# Altium schematic sheet STM32F1_MCU.SchDoc
size 420 x 297 mm; SheetNumber: 1; SheetTotal: 2
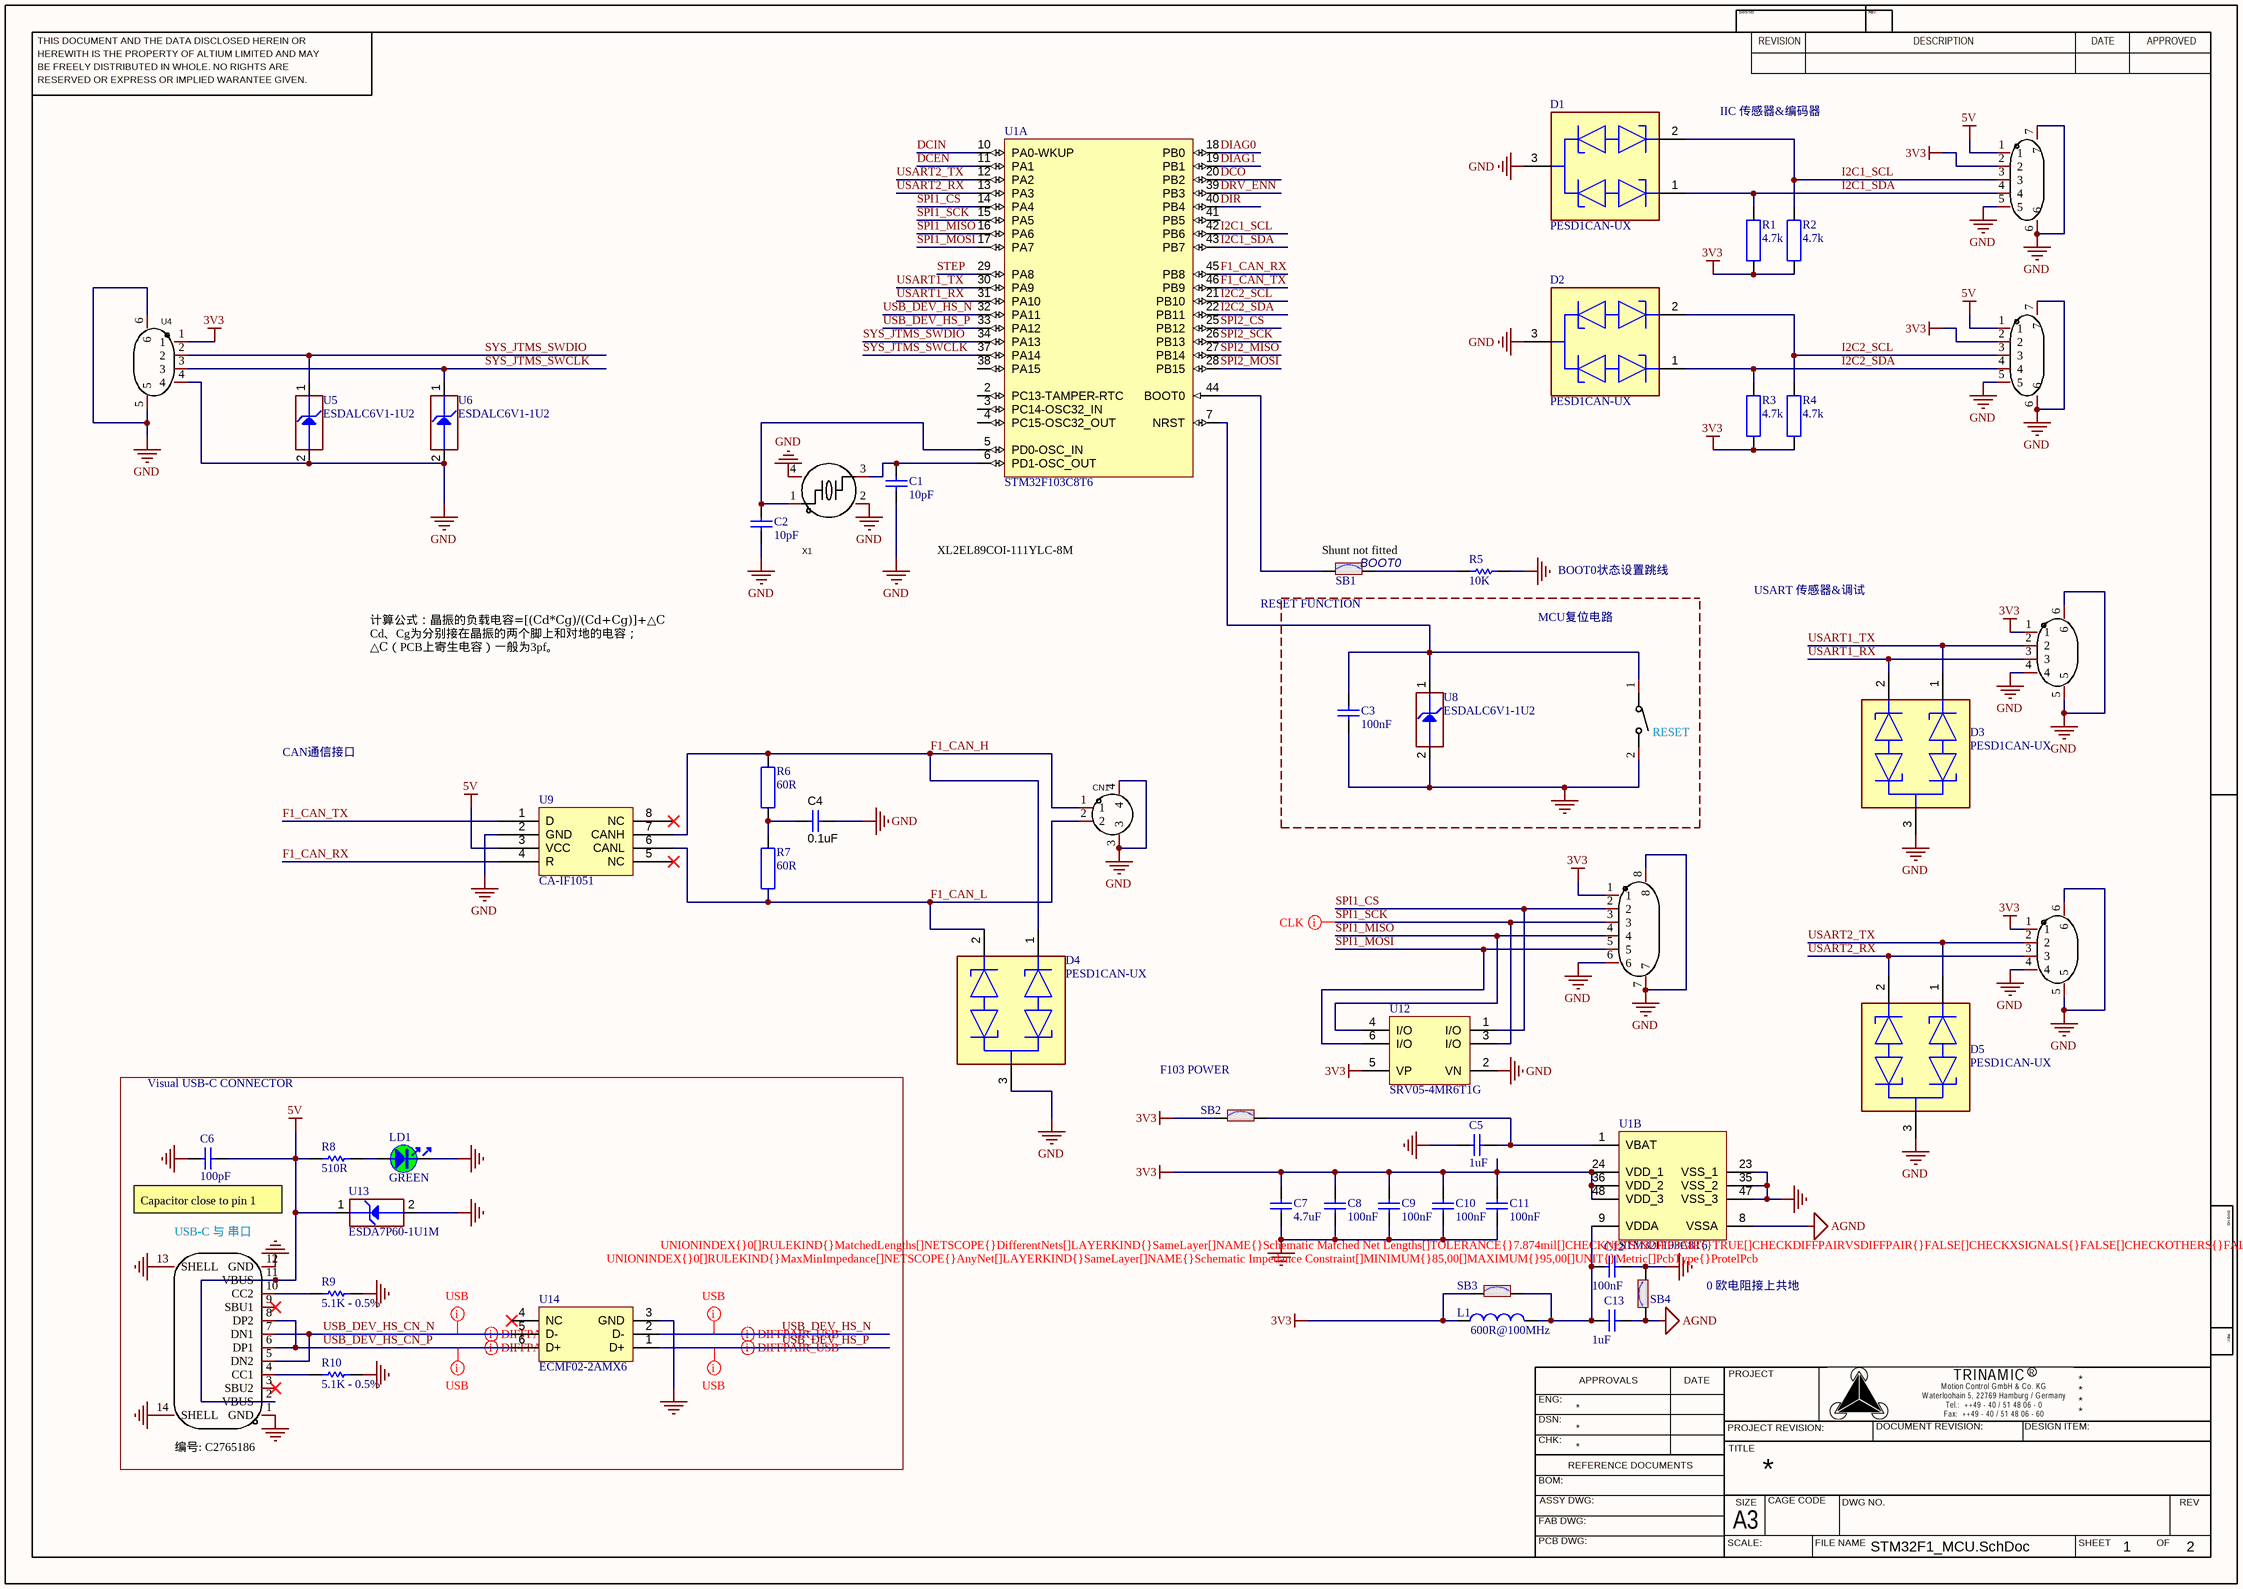
[diagram p0: STM32F1_MCU.SchDoc]

## Parts
C1  value 10pF  [C0402]
C2  value 10pF  [C0402]
C3  value 100nF  [C0402]
C4  ValueDisplayed: 0.1uF  [0603L]  (hidden comment: GRM188R61E105KA12D)
C5  value 1uF  [C0603]
C6  value 100pF  [C0402]
C7  value 4.7uF  [C0603]
C8  value 100nF  [C0402]
C9  value 100nF  [C0402]
C10  value 100nF  [C0402]
C11  value 100nF  [C0402]
C12  value 100nF  [C0402]
C13  value 1uF  [C0603]
CN1  WAFER-GH1.25-2PWB  [CONN-TH_2P-P1.25_XUNPU_WAFER-GH1.25-2PWB]  (value not drawn)
D1  PESD1CAN-UX  [FP-SOT323-MFG]
D2  PESD1CAN-UX  [FP-SOT323-MFG]
D3  PESD1CAN-UX  [FP-SOT323-MFG]
D4  PESD1CAN-UX  [FP-SOT323-MFG]
D5  PESD1CAN-UX  [FP-SOT323-MFG]
L1  value 600R@100MHz  [L0603]
LD1  value GREEN  [LED_0603_GREEN]
R1  4.7k  [RESC1608X55N]
R2  4.7k  [RESC1608X55N]
R3  4.7k  [RESC1608X55N]
R4  4.7k  [RESC1608X55N]
R5  value 10K  [R0603]
R6  60R  [RESC1608X55N]
R7  60R  [RESC1608X55N]
R8  value 510R  [R0603]
R9  value 5.1K - 0.5%  [R0603]
R10  value 5.1K - 0.5%  [R0603]
SB1  MCD-00071  [SOLDER-BRIDGE_R0603-0R]  (value not drawn)
SB2  (no value)  [SOLDER-BRIDGE_R0603-0R]
SB3  (no value)  [SOLDER-BRIDGE_R0603-0R]
SB4  (no value)  [SOLDER-BRIDGE_R0603-0R]
SW1  TS-1088-AR02016  [SW-SMD_L3.9-W3.0-P4.45]  (value not drawn)
U1  STM32F103C8T6  [STM-LQFP48_L]  (parts A,B of 2)
U2  WAFER-GH1.25-5PWB  [CONN-SMD_5P-P1.25_XUNPU_WAFER-GH1.25-5PWB]  (value not drawn)
U3  WAFER-GH1.25-5PWB  [CONN-SMD_5P-P1.25_XUNPU_WAFER-GH1.25-5PWB]  (value not drawn)
U4  WAFER-GH1.25-4PWB  [CONN-SMD_4P-P1.25_XUNPU_WAFER-GH1.25-4PWB]  (value not drawn)
U5  value ESDALC6V1-1U2  [ESD_ST0201]
U6  value ESDALC6V1-1U2  [ESD_ST0201]
U7  WAFER-GH1.25-4PWB  [CONN-SMD_4P-P1.25_XUNPU_WAFER-GH1.25-4PWB]  (value not drawn)
U8  value ESDALC6V1-1U2  [ESD_ST0201]
U9  CA-IF1051  [SOIC127P600X175-8N]
U10  WAFER-GH1.25-6PWB  [CONN-SMD_6P-P1.25_XUNPU_WAFER-GH1.25-6PWB]  (value not drawn)
U11  WAFER-GH1.25-4PWB  [CONN-SMD_4P-P1.25_XUNPU_WAFER-GH1.25-4PWB]  (value not drawn)
U12  SRV05-4MR6T1G  [ONSC-TSOP-6-318G-02_V]
U13  value ESDA7P60-1U1M  [ESD_QFN2_1P6X1_P125]
U14  value ECMF02-2AMX6  [ESD_QFN-6L_1P7X1P5_P050]  (hidden comment: ​)
USB1  TYPE-C 16PIN 2MD(073)  [USB-C-SMD_TYPE-C-6PIN-2MD-073]  (value not drawn)
X1  8MHz  [CRYSTAL-SMD_4P-L3.2-W2.5-BL-1]  (value not drawn)

## Nets
3V3: C7.2 C8.2 C9.2 C10.2 C11.2 L1.1 R1.2 R2.2 R3.2 R4.2 SB2.1 SB3.1 U1.24(VDD_1) U1.36(VDD_2) U1.48(VDD_3) U2.2 U3.2 U4.1 U7.1 U10.1 U11.1 U12.5(VP)
5V: C6.2 R8.2 U2.1 U3.1 U9.3(VCC) U13.1(IO1) USB1.2(VBUS) USB1.11(VBUS)
AGND: C13.1 SB4.1 U1.8(VSSA)
GND: C1.2 C2.2 C3.1 C4.2 C5.1 C6.1 C7.1 C8.1 C9.1 C10.1 C11.1 C12.1 CN1.3 CN1.4 D1.3(common_cathode) D2.3(common_cathode) D3.3(common_cathode) D4.3(common_cathode) D5.3(common_cathode) LD1.2 R5.1 R9.1 R10.1 SB4.2 SW1.2 U1.23(VSS_1) U1.35(VSS_2) U1.47(VSS_3) U2.5 U2.6 U2.7 U3.5 U3.6 U3.7 U4.4 U4.5 U4.6 U5.2(GND) U6.2(GND) U7.4 U7.5 U7.6 U8.2(GND) U9.2(GND) U10.6 U10.7 U10.8 U11.4 U11.5 U11.6 U12.2(VN) U13.2(GND) U14.3(GND) USB1.1(GND) USB1.12(GND) USB1.13(SHELL) USB1.14(SHELL) X1.2(GND) X1.4(GND)
DCEN: U1.11(PA1)
DCIN: U1.10(PA0-WKUP)
DCO: U1.20(PB2)
DIAG0: U1.18(PB0)
DIAG1: U1.19(PB1)
DIR: U1.40(PB4)
DRV_ENN: U1.39(PB3)
F1_CAN_H: CN1.1 D4.1(cathode_1) R6.2 U9.7(CANH)
F1_CAN_L: CN1.2 D4.2(cathode_2) R7.1 U9.6(CANL)
F1_CAN_RX: U1.45(PB8) U9.4(R)
F1_CAN_TX: U1.46(PB9) U9.1(D)
I2C1_SCL: D1.2(cathode_2) R2.1 U1.42(PB6) U2.3
I2C1_SDA: D1.1(cathode_1) R1.1 U1.43(PB7) U2.4
I2C2_SCL: D2.2(cathode_2) R4.1 U1.21(PB10) U3.3
I2C2_SDA: D2.1(cathode_1) R3.1 U1.22(PB11) U3.4
SPI1_CS: U1.14(PA4) U10.2 U12.1(I/O)
SPI1_MISO: U1.16(PA6) U10.4 U12.4(I/O)
SPI1_MOSI: U1.17(PA7) U10.5 U12.6(I/O)
SPI1_SCK: U1.15(PA5) U10.3 U12.3(I/O)
SPI2_CS: U1.25(PB12)
SPI2_MISO: U1.27(PB14)
SPI2_MOSI: U1.28(PB15)
SPI2_SCK: U1.26(PB13)
STEP: U1.29(PA8)
SYS_JTMS_SWCLK: U1.37(PA14) U4.3 U6.1(IO1)
SYS_JTMS_SWDIO: U1.34(PA13) U4.2 U5.1(IO1)
USART1_RX: D3.2(cathode_2) U1.31(PA10) U7.3
USART1_TX: D3.1(cathode_1) U1.30(PA9) U7.2
USART2_RX: D5.2(cathode_2) U1.13(PA3) U11.3
USART2_TX: D5.1(cathode_1) U1.12(PA2) U11.2
USB_DEV_HS_CN_N: U14.5(D-) USB1.5(DN2) USB1.7(DN1)
USB_DEV_HS_CN_P: U14.6(D+) USB1.6(DP1) USB1.8(DP2)
USB_DEV_HS_N: U1.32(PA11) U14.2(D-)
USB_DEV_HS_P: U1.33(PA12) U14.1(D+)
NetC1_1: C1.1 U1.6(PD1-OSC_OUT) X1.3
NetC2_1: C2.1 U1.5(PD0-OSC_IN) X1.1
NetC3_2: C3.2 SW1.1 U1.7(NRST) U8.1(IO1)
NetC4_1: C4.1 R6.1 R7.2
NetC5_2: C5.2 SB2.2 U1.1(VBAT)
NetC12_2: C12.2 C13.2 L1.2 SB3.2 U1.9(VDDA)
NetLD1_1: LD1.1 R8.1
NetR5_2: R5.2 SB1.2
NetR9_2: R9.2 USB1.10(CC2)
NetR10_2: R10.2 USB1.4(CC1)
NetSB1_1: SB1.1 U1.44(BOOT0)

Not connected (* = marked no-connect by the designer): U1 2(PC13-TAMPER-RTC) 3(PC14-OSC32_IN) 4(PC15-OSC32_OUT) 38(PA15) 41(PB5); U9 5(NC)* 8(NC)*; U14 4(NC)*; USB1 3(SBU2)* 9(SBU1)*

## Layout directives
differential pair; rule Impedance Constraint [Min = 85.00    Max = 95.00    ]: USB_DEV_HS_CN_N, USB_DEV_HS_CN_P, USB_DEV_HS_N, USB_DEV_HS_P
rule Undefined; rule Matched Net Lengths [Tolerance = 0.2mm]; rule Impedance Constraint [Min = 85.00    Max = 95.00    ]: USB_DEV_HS_CN_N, USB_DEV_HS_CN_P, USB_DEV_HS_N, USB_DEV_HS_P
mark named CLK: SPI1_SCK

## Notes on the sheet
- IIC 传感器&编码器
- XL2EL89COI-111YLC-8M
- (near SB1) Shunt not fitted
- BOOT0
- BOOT0状态设置跳线
- USART 传感器&调试
- 计算公式：晶振的负载电容=[(Cd*Cg)/(Cd+Cg)]+△C
  Cd、Cg为分别接在晶振的两个脚上和对地的电容；
  △C（PCB上寄生电容）一般为3pf。
- RESET FUNCTION
- MCU复位电路
- CAN通信接口
- (near SW1) RESET
- (near SB2) F103 POWER
- Visual USB-C CONNECTOR
- (near C6) Capacitor close to pin 1
- (near USB1) USB-C 与 串口
- 0 欧电阻接上共地
- (near USB1) 编号: C2765186
- THIS DOCUMENT AND THE DATA DISCLOSED HEREIN OR
- HEREWITH IS THE PROPERTY OF ALTIUM LIMITED AND MAY
- DWG NO:
- REVISION
- REV:
- DESCRIPTION
- DATE
- APPROVED
- BE FREELY DISTRIBUTED IN WHOLE. NO RIGHTS ARE
- RESERVED OR EXPRESS OR IMPLIED WARANTEE GIVEN.
- ENG:
- APPROVALS
- PROJECT
- DSN:
- CHK:
- REFERENCE DOCUMENTS
- PROJECT REVISION:
- TITLE
- DOCUMENT REVISION:
- DESIGN ITEM:
- BOM:
- FAB DWG:
- PCB DWG:
- ASSY DWG:
- SCALE:
- A3
- SIZE
- CAGE CODE
- FILE NAME
- DWG NO.
- SHEET
- OF
- REV

## Library data of the parts
C1 C2 = MCD-00003: Capacitor, MLCC, 5.1pF, 50V, NPO, +-0.25pF, 0402, T=0.5mm; Manufacturer_Part_Number: CC0402CRNPO9BN5R1; Manufacturer: YAGEO; ECCN_US: EAR99; ECCN_EU: NEC; Provided_By: SUBCO; Internal_Part_Number: MCD-00003; ComponentLink1Description: Datasheet; Status: Released; Part_Type: Capacitor; Package: C0402; ComponentLink1URL: http://tunmcdsvn.tun.st.com/Component_Datasheet_Library/Trunk/Capacitors/Yageo_Capacitor_NP0_16V-to-50V
C3 C8-C12 = MCD-00102: Capacitor, MLCC, 100nF, 16V, X7R, 10%, 0402, T=0,5mm; Manufacturer_Part_Number: CC0402KRX7R7BB104; Manufacturer: YAGEO; Provided_By: Subcon; Initial_Board_Reference: MB1262; Internal_Part_Number: MCD-00102; Status: Released; Package: C0402; ComponentLink1Description: Yageo_Capacitor_X7R-series.pdf; ECCN_US: n/a; ECCN_EU: n/a; Part_Type: Capacitor; ComponentLink1URL: http://tunmcdsvn.tun.st.com/Component_Datasheet_Library/Trunk/Capacitors/Yageo_Multilayer_Capacitor_X7R_series_100pF_to_22uF
C4 = GRM188R61E105KA12D: CAP, CERM, 0.1uF, 25V, +/-10%, X5R, 0603; Manufacturer: MuRata; Polarized: N; CompType: Capacitor; Value: 1uF; U/M: EA; Cap_F: 0.000001; Tolerance_%: 10; Value1: Unknown; VDC_V: 25; TaMin_C: -55; TaMax_C: 85; Cap_Case: 0603; SymbolVersion: 2008-07-09; PartNumber: GRM188R61E105KA12D; PackageReference: 0603; RoHS: Y; Value2: 25V; MountType: SMT; Technology: Ceramic; TempCo: X5R; Published: 2008-06-19; Publisher: Texas Instruments; LatestRevisionDate: 2013-05-24; LatestRevisionNote: Changed publisher; ComponentLink1Description: Datasheet link; ComponentLink1URL: http://search.murata.co.jp/Ceramy/PnsearchViewAction.do?HnOFG=ON&HnNFG=ON&SEL_CNT=50&sLang=en&sKey=GRM188R61E105KA12D&x=9&y=9&search=startwith; Supplier 1: Digi-Key; Supplier Part Number 1: 490-3897-1-ND; Supplier 2: Mouser; Supplier Part Number 2: 81-GRM188R61E105KA12; Supplier 3: Farnell; Supplier Part Number 3: 1828802
C5 C13 = MCD-00010: Capacitor, MLCC, 1uF, 16V, X5R, 10%, 0603, T=0,8mm; Manufacturer_Part_Number: CC0603KRX5R7BB105; Manufacturer: YAGEO; Provided_By: Subcon; Initial_Board_Reference: MB1274; Internal_Part_Number: MCD-00010; Status: Released; Package: C0603; ComponentLink1Description: Yageo_Capacitor_X5R-series.pdf; ECCN_US: n/a; ECCN_EU: n/a; Part_Type: Capacitor; ComponentLink1URL: http://tunmcdsvn.tun.st.com/Component_Datasheet_Library/Trunk/Capacitors/Yageo_Multilayer_capacitor_X5R_series_100pF_to_100uF
C6 = MCD-00205: Capacitor, MLCC, 100pF, 50V, NPO, 5%, 0402, T=0,5mm; Manufacturer_Part_Number: CC0402JRNPO9BN101; Manufacturer: YAGEO; Provided_By: Subcon; Internal_Part_Number: MCD-00205; Status: Footprint available; Part_Type: Capacitor; Package: C0402; ComponentLink1Description: Yageo_Capacitor_NP0_16V-to-50V.pdf; ComponentLink1URL: http://tunmcdsvn.tun.st.com/Component_Datasheet_Library/Trunk/Capacitors/Yageo_Capacitor_NP0_16V-to-50V
C7 = MCD-00009: Capacitor, MLCC, 4.7uF, 16V, X5R, 10%, 0603, T=0.8mm; Manufacturer_Part_Number: CC0603KRX5R7BB475; Manufacturer: YAGEO; Provided_By: subcon; Initial_Board_Reference: MB1274; Internal_Part_Number: MCD-00009; ComponentLink1Description: Yageo_Capacitor_X5R-series.pdf; ECCN_US: n/a; ECCN_EU: n/a; Status: Released; Part_Type: Capacitor; Package: C0603; ComponentLink1URL: http://tunmcdsvn.tun.st.com/Component_Datasheet_Library/Trunk/Capacitors/Yageo_Multilayer_capacitor_X5R_series_100pF_to_100uF
CN1 = WAFER-GH1.25-2PWB: Manufacturer: XUNPU(讯普); Add into BOM: yes; Pins Structure: 1x2P; Pitch: 1.25mm; Reference Series: GH; Number of PINs Per Row: 2; Current Rating (Max): 1A; Symbol: WAFER-GH1.25-2PWB; Device: WAFER-GH1.25-2PWB; LCSC Part Name: 1x2P 间距:1.25mm 卧贴 系列:GH; Supplier Part: C3029377; Manufacturer Part: WAFER-GH1.25-2PWB; Supplier Footprint: SMD,P=1.25mm,卧贴; JLCPCB Part Class: Extended Part; Datasheet: https://atta.szlcsc.com/upload/public/pdf/source/20220527/CB8773BFB0913C3B8ABD62CB38BA101A.pdf; Supplier: LCSC; Convert to PCB: yes; Mounting Style: 卧贴; Number of Pins: 2P; Number of Rows: 1; Operating Temperature Range: -25℃~+85℃
D1-D5 = CMP-14436-000006-1: TVS DIODE 24V 50V SC70-3
L1 = MCD-00047: SMD Chip ferrite bead, 600R@100MHz +/-25%, 350mA, 500mohm DC, 0603, T=0.8mm; Part_Type: Inductor; Manufacturer_Part_Number: FCM1608KF-601T03; Manufacturer: TAI-TECH; Provided_By: SUBCO; Internal_Part_Number: MCD-00047; Status: Released; ComponentLink1Description: Datasheet; ComponentLink1URL: http://tunmcdsvn.tun.st.com/Component_Datasheet_Library/Trunk/Inductors/TaiTech_Bead_FCM1608_series; ECCN_US: n/a; ECCN_EU: n/a
LD1 = MCD-00050: LED, Green, 0603; Manufacturer_Part_Number: 19-213SYGC/S530-E2/TR8; Manufacturer: EVERLIGHT; Part_Type: Display; ECCN_US: EAR99; ECCN_EU: NEC; Provided_By: SUBCO; Internal_Part_Number: MCD-00050; ComponentLink1Description: Datasheet; Status: Released; ComponentLink1URL: http://tunmcdsvn.tun.st.com/Component_Datasheet_Library/Trunk/Display/Everlight_SMD-LED-GREEN_19-213SYGC-S530-XX-TR8-v3.doc; Package: LED 0603
R1-R4 = RC0603FR-073K3L: RES SMD 4.7K OHM 1% 1/10W 0603; Manufacturer: Yageo; Resistance (Ohms): 3.3k; Power (Watts): 0.1W, 1/10W; Temperature Coefficient: ±100ppm/°C; Supplier 1: Digi-Key; Supplier Part Number 1: 311-3.30KHRCT-ND; Manufacturer Part Number: RC0603FR-073K3L; RoHS: RoHS Compliant; Category: Resistors; Stock 1: 420019; Pricing 1: 1=0.1, 10=0.014, 25=0.01, 100=0.0057, 250=0.00436, 500=0.00348, 1000=0.00257, 2500=0.00223 (USD); Packaging: Cut Tape (CT); Tolerance: ±1%; Composition: Thick Film; Features: Moisture Resistant; Operating Temperature: -55°C ~ 155°C; Package / Case: 0603 (1608 Metric); Supplier Device Package: 0603; Size / Dimension: 0.063" L x 0.031" W (1.60mm x 0.80mm); Height: 0.022" (0.55mm); Number of Terminations: 2; ComponentLink1URL: http://www.yageo.com/documents/recent/PYu-RC_Group_51_RoHS_L_04.pdf; ComponentLink1Description: http://www.yageo.com/documents/recent/PYu-RC_Group_51_RoHS_L_04.pdf
R5 = MCD-00220: Resistor,10K,0603,1%,1/10W; Manufacturer_Part_Number: RC0603FR-0710KL; Manufacturer: YAGEO; Provided_By: Subcon; Initial_Board_Reference: MB1319; Internal_Part_Number: MCD-00220; ECCN_US: n/a; ECCN_EU: n/a; ComponentLink1Description: Yageo_Resistor_RC0603-series.pdf; Status: Released; Part_Type: Resistor; Package: R0603; ComponentLink1URL: http://tunmcdsvn.tun.st.com/Component_Datasheet_Library/Trunk/Resistors/Yageo_Resistor_RC0603-series
R6 R7 = RC0603FR-07120RL: RES SMD 60 OHM 1% 1/10W 0603; Manufacturer: Yageo; Resistance (Ohms): 120; Power (Watts): 0.1W, 1/10W; Temperature Coefficient: ±100ppm/°C; Supplier 1: Digi-Key; Supplier Part Number 1: 311-120HRCT-ND; Manufacturer Part Number: RC0603FR-07120RL; RoHS: RoHS Compliant; Category: Resistors; Stock 1: 1545282; Pricing 1: 1=0.1, 10=0.014, 25=0.01, 100=0.0057, 250=0.00436, 500=0.00348, 1000=0.00257, 2500=0.00223 (USD); Packaging: Cut Tape (CT); Tolerance: ±1%; Composition: Thick Film; Features: Moisture Resistant; Operating Temperature: -55°C ~ 155°C; Package / Case: 0603 (1608 Metric); Supplier Device Package: 0603; Size / Dimension: 0.063" L x 0.031" W (1.60mm x 0.80mm); Height: 0.022" (0.55mm); Number of Terminations: 2; ComponentLink1URL: http://www.yageo.com/documents/recent/PYu-RC_Group_51_RoHS_L_04.pdf; ComponentLink1Description: http://www.yageo.com/documents/recent/PYu-RC_Group_51_RoHS_L_04.pdf
R8 = MCD-00225: Resistor,510R,0603,1%,1/10W; Manufacturer_Part_Number: RC0603FR-07510RL; Manufacturer: YAGEO; ECCN_US: EAR99; ECCN_EU: NEC; Provided_By: SUBCO; Internal_Part_Number: MCD-00225; ComponentLink1Description: Datasheet; Status: Released; Part_Type: Resistor; Package: R0603; ComponentLink1URL: http://tunmcdsvn.tun.st.com/Component_Datasheet_Library/Trunk/Resistors/Yageo_Resistor_RC0603-series
R9 R10 = MCD-01209: Resistor,5.1K,0603,0.5%,1/10W; Manufacturer_Part_Number: RC0603DR-0733KL; Manufacturer: YAGEO; ECCN_US: EAR99; ECCN_EU: NEC; Provided_By: SUBCO; Internal_Part_Number: MCD-01209; Status: Checked; Part_Type: Resistor; Package: R0603; ComponentLink1Description: Datasheet; ComponentLink1URL: http://tunmcdsvn.tun.st.com/Component_Datasheet_Library/Trunk/Resistors/Yageo_Resistor_RC0603-series/RC_Group_51_RoHS_L_7.pdf
SB1-SB4 = MCD-00071: Solder Bridge ON; Part_Type: Mechanical; Manufacturer_Part_Number: RC0603JR-070RL; Manufacturer: YAGEO; Provided_By: SUBCO; Internal_Part_Number: MCD-00071; ECCN_US: n/a; ECCN_EU: n/a; Status: Released; Package: SB0603; ComponentLink1Description: Datasheet; ComponentLink1URL: http://tunmcdsvn.tun.st.com/Component_Datasheet_Library/Trunk/Resistors/Yageo_Resistor_RC0603-series
SW1 = TS-1088-AR02016: Manufacturer: XUNPU(讯普); Add into BOM: yes; Circuit: 单刀单掷; Actuator Style: 圆形按钮; Operating Force: 160gf; Switch Length: 4mm; Switch Width: 3mm; Switch Height: 2mm; Strike Gundam: 不带; Contact Current: 50mA; Voltage Rating (DC): 12V; Insulation Resistance: 100MΩ; Actuator/Cap Color: 黑色; Pin Style: SMD接片; Mechanical Life: 10万次; Symbol: TS-1088-AR02016; Device: TS-1088-AR02016; LCSC Part Name: 4*3*2mm 立贴 轻触开关; Supplier Part: C720477; Manufacturer Part: TS-1088-AR02016; Supplier Footprint: SMD; JLCPCB Part Class: Extended Part; Datasheet: https://atta.szlcsc.com/upload/public/pdf/source/20200810/C720475_60D09DD6C54279ADDB2DC25100F1CC11.pdf; Supplier: LCSC; Convert to PCB: yes; Mounting Style: 立贴; Operating Temperature: -30℃~+80℃
U1 = CMP-0237-00215-3: ARM Cortex-M3 32-bit MCU, 64 KB Flash, 20 KB Internal RAM, 37 I/Os, 48-pin LQFP, -40 to 85 degC, Tray; Supply Voltage(Vcc) min (V): 2; Internal RAM Size (kB): 20; FLASH Size (Prog) (kB): 64; A/D Converter: 2x12-bit (10 Channel); I/Os (High Current): 37; Operating Frequency(F) (Processor speed) (MHz): 72; Core: ARM Cortex-M3; ComponentLink3Description: Package Specification; Mounting Technology: Surface Mount; PartNumber: STM32F103C8T6; PackageReference: LQFP48; Packing: Tray; ComponentLink3URL: http://www.st.com/st-web-ui/static/active/en/resource/technical/document/datasheet/DM00058181.pdf; DatasheetVersion: Rev. 16; ComponentLink1URL: http://www.st.com/web/en/home.html; PackageVersion: Rev. 6, 06/2013; ComponentLink2URL: http://www.st.com/st-web-ui/static/active/en/resource/technical/document/datasheet/CD00161566.pdf; ComponentLink1Description: Manufacturer URL; ComponentLink2Description: Datasheet; PackageDescription: 48-Pin Low Profile Quad Flat Package, 7 x 7 mm Body, 0.5 mm Pitch
U2 U3 = WAFER-GH1.25-5PWB: Manufacturer: XUNPU(讯普); Add into BOM: yes; Pins Structure: 1x5P; Pitch: 1.25mm; Reference Series: GH; Number of PINs Per Row: 5; Current Rating (Max): 1A; Symbol: WAFER-GH1.25-5PWB; Device: WAFER-GH1.25-5PWB; LCSC Part Name: 1x5P 间距:1.25mm 卧贴 系列:GH; Supplier Part: C3029380; Manufacturer Part: WAFER-GH1.25-5PWB; Supplier Footprint: SMD,P=1.25mm,卧贴; JLCPCB Part Class: Extended Part; Datasheet: https://atta.szlcsc.com/upload/public/pdf/source/20220527/CB8773BFB0913C3B8ABD62CB38BA101A.pdf; Supplier: LCSC; Convert to PCB: yes; Mounting Style: 卧贴; Number of Pins: 5P; Number of Rows: 1; Operating Temperature Range: -25℃~+85℃
U4 U7 U11 = WAFER-GH1.25-4PWB: Manufacturer: XUNPU(讯普); Add into BOM: yes; Pins Structure: 1x4P; Pitch: 1.25mm; Reference Series: GH; Number of PINs Per Row: 4; Current Rating (Max): 1A; Symbol: WAFER-GH1.25-4PWB; Device: WAFER-GH1.25-4PWB; LCSC Part Name: 1x4P 间距:1.25mm 卧贴 系列:GH; Supplier Part: C3029379; Manufacturer Part: WAFER-GH1.25-4PWB; Supplier Footprint: SMD,P=1.25mm,卧贴; JLCPCB Part Class: Extended Part; Datasheet: https://atta.szlcsc.com/upload/public/pdf/source/20220527/CB8773BFB0913C3B8ABD62CB38BA101A.pdf; Supplier: LCSC; Convert to PCB: yes; Mounting Style: 卧贴; Number of Pins: 4P; Number of Rows: 1; Operating Temperature Range: -25℃~+85℃
U5 U6 U8 = MCD-00170: ESD protection 6V1; Part_Type: Diode; Manufacturer: STMICROELECTRONICS; ECCN_US: EAR99; ECCN_EU: NEC; Provided_By: Subcon; Initial_Board_Reference: MB1274; Internal_Part_Number: MCD-00170; Status: Released; Manufacturer_Part_Number: ESDALC6V1-1U2; ComponentLink1Description: STM_ESD_ESDALC6V1-1U2.pdf; ComponentLink1URL: http://tunmcdsvn.tun.st.com/Component_Datasheet_Library/Trunk/Diodes/STM_ESD_ESDALC6V1-1U2
U9 = SN65HVD232D: Manufacturer: Texas Instruments; Protocol: CAN; Number of Drivers/Receivers: 1/1; Duplex: Half; Data Rate: 1Mbps; Voltage - Supply: 3 V ~ 3.6 V; Supplier 1: Digi-Key; Supplier Part Number 1: 296-26344-2-ND; RoHS: RoHS Compliant; Category: Integrated Circuits (ICs); Stock: 5000; Pricing 1: 2500=0.84375 (USD); Packaging: Tape & Reel (TR); Part Status: Active; Type: Transceiver; Operating Temperature: -40°C ~ 85°C; Mounting Type: Surface Mount; Package / Case: 8-SOIC (0.154", 3.90mm Width); Supplier Device Package: 8-SOIC; ComponentLink1URL: http://www.ti.com/lit/ds/symlink/sn65hvd230.pdf; ComponentLink1Description: http://www.ti.com/lit/ds/symlink/sn65hvd230.pdf; Supplier 2: Digi-Key; Supplier Part Number 2: 296-26344-1-ND; Pricing 2: 1=2.05, 10=1.842, 100=1.4809, 500=1.21668, 1000=1.00811 (USD); Manufacturer Part Number: CA-IF1051
U10 = WAFER-GH1.25-6PWB: Manufacturer: XUNPU(讯普); Add into BOM: yes; Pins Structure: 1x6P; Pitch: 1.25mm; Reference Series: GH; Number of PINs Per Row: 6; Current Rating (Max): 1A; Symbol: WAFER-GH1.25-6PWB; Device: WAFER-GH1.25-6PWB; LCSC Part Name: 1x6P 间距:1.25mm 卧贴 系列:GH; Supplier Part: C3029381; Manufacturer Part: WAFER-GH1.25-6PWB; Supplier Footprint: SMD,P=1.25mm,卧贴; JLCPCB Part Class: Extended Part; Datasheet: https://atta.szlcsc.com/upload/public/pdf/source/20220527/CB8773BFB0913C3B8ABD62CB38BA101A.pdf; Supplier: LCSC; Convert to PCB: yes; Mounting Style: 卧贴; Number of Pins: 6P; Number of Rows: 1; Operating Temperature Range: -25℃~+85℃
U12 = CMP-1061-00729-1: Transient Voltage Suppressor, ESD Protection Diodes with Low Clamping Voltage, 6-Pin TSOP, Pb-Free, Tape and Reel; Manufacturer: On Semiconductor; IR Max (uA): 5; Direction: Unidirectional; PPK Max (W): 300; DatasheetVersion: Rev. 1; ComponentLink2Description: Datasheet; ComponentLink3Description: Package Specification; ComponentLink1Description: Manufacturer URL; PartNumber: SRV05-4MR6T1G; PackageReference: TSOP-6-318G-02; PackageDescription: 6-Pin Small Outline Package, Body 3 x 1.5 mm, Pitch 0.95 mm; ComponentLink1URL: http://www.onsemi.com/; ComponentLink2URL: http://www.onsemi.com/pub_link/Collateral/SRV05-4-D.PDF; Packing: Tape and Reel; Mounting Technology: Surface Mount; ComponentLink3URL: http://www.onsemi.com/pub_link/Collateral/318G-02.PDF; PackageVersion: Rev. V, 06/2012; RoHS: Pb-Free
U13 = MCD-00251: High power transient voltage suppressor, 7V breakdown; Part_Type: IC; Manufacturer: STMICROELECTRONICS; ECCN_US: EAR99; ECCN_EU: NEC; Provided_By: Subcon; Initial_Board_Reference: MB1311; Internal_Part_Number: MCD-00251; Status: Released; Manufacturer_Part_Number: ESDA7P60-1U1M; ComponentLink1Description: STM_ESD_ESDA7P60-1U1M.pdf; ComponentLink1URL: http://tunmcdsvn.tun.st.com/Component_Datasheet_Library/Trunk/Diodes/STM_ESD_ESDA7P60-1U1M
U14 = MCD-00649: Common mode filter with ESD protection for USB 2.0 interface; Part_Type: Diode; Manufacturer: STMICROELECTRONICS; ECCN_US: EAR99; ECCN_EU: NEC; Provided_By: Subcon; Initial_Board_Reference: MB1248; Internal_Part_Number: MCD-00649; Status: Footprint available; Manufacturer_Part_Number: ECMF02-2AMX6; ComponentLink1Description: STM_ESD_ECMF02-2AMX6.pdf; ComponentLink1URL: http://tunmcdsvn.tun.st.com/Component_Datasheet_Library/Trunk/Diodes/STM_ESD_ECMF02-2AMX6
USB1 = TYPE-C 16PIN 2MD(073): Manufacturer: SHOU HAN(首韩); Add into BOM: yes; Gender: 母; Number of Ports: 1; Number of Contacts: 16P; Current Rating - Power (Max): 5A; Symbol: TYPE-C 16PIN 2MD(073); Device: TYPE-C 16PIN 2MD(073); LCSC Part Name: Type-C 母 卧贴; Supplier Part: C2765186; Manufacturer Part: TYPE-C 16PIN 2MD(073); Supplier Footprint: SMD; JLCPCB Part Class: Extended Part; Datasheet: https://atta.szlcsc.com/upload/public/pdf/source/20211123/39B17C16241EAC15C5E277BDA434118E.pdf; Supplier: LCSC; Convert to PCB: yes; Connector Type: Type-C; Standard: -; Mounting Style: 卧贴; Operating Temperature Range: -25℃~+85℃
X1 = XL2EL89COI-111YLC-8M: Manufacturer: YXC(扬兴晶振); Add into BOM: yes; Crystal Type: 贴片晶振; Normal temperature Frequency Tolerance: ±10ppm; External load capacitor: 12pF; Frequency Stability(Full temperature range): ±20ppm; Equivalent Series Resistance (ESR): 150Ω; Symbol: XL2EL89COI-111YLC-8M; Device: XL2EL89COI-111YLC-8M; LCSC Part Name: 8MHz ±10ppm 12pF; Supplier Part: C2973805; Manufacturer Part: XL2EL89COI-111YLC-8M; Supplier Footprint: SMD3225-4P; JLCPCB Part Class: Extended Part; Datasheet: https://atta.szlcsc.com/upload/public/pdf/source/20240329/19D5F850207469550BEB00D7DFEDBC7A.pdf; Supplier: LCSC; Convert to PCB: yes; Value: 8MHz; Operating Temperature: -40℃~+85℃